# EasyEDA Pro project HT6872_D类功放测试板.eprj

# Schematic HT6872功放验证板
Create Date: 2024-03-28; Page Name: HT6872+SDB628; Project Name: HT6872_D类功放测试板; Schematic Name: Schematic1; Update Date: 2024-03-28; Company: 嘉立创EDA; Drawed: Cameron Bright; Page Size: A4; Version: V1.0
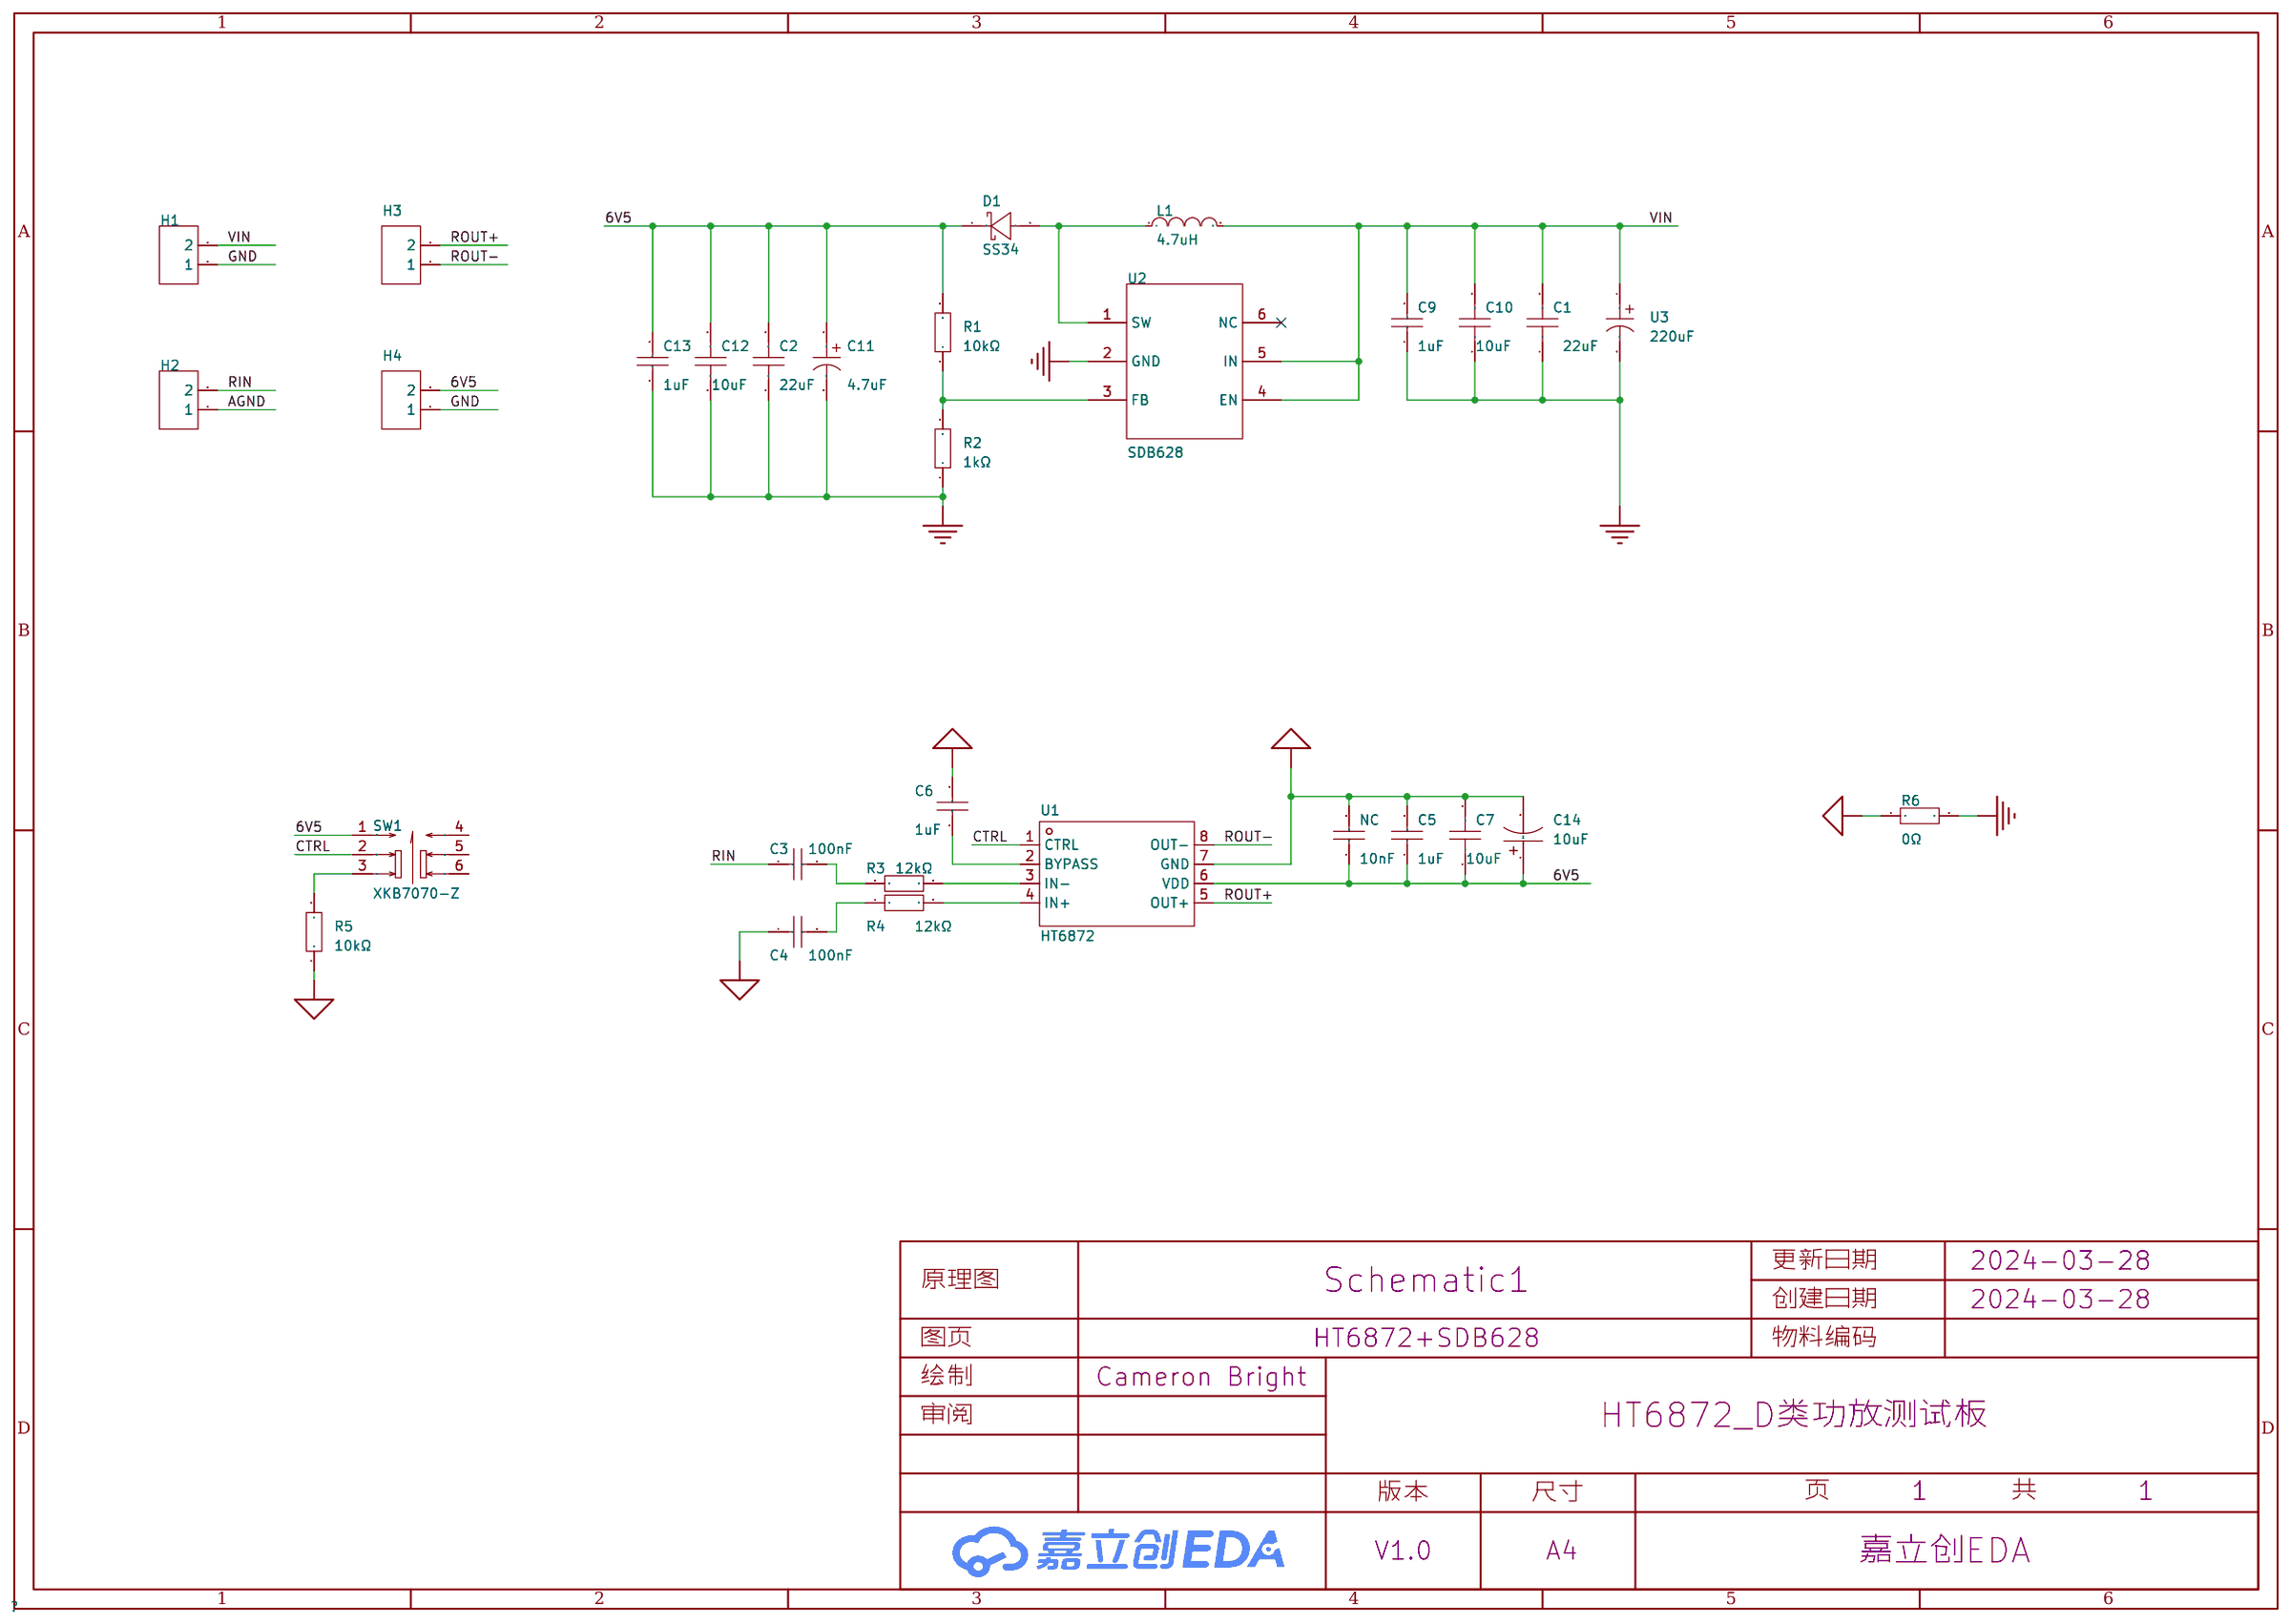
[diagram p0: schematic sheet]

## Parts
C1  22uF  [C0603]
C2  22uF  [C0603]
C3  100nF  [C0603]
C4  100nF  [C0603]
C5  1uF  [C0603]
C6  1uF  [C0603]
C7  10uF  [C0603]
C9  1uF  [C0603]
C10  10uF  [C0603]
C11  4.7uF  [CAP-TH_BD5.0-P2.00-D0.5-FD]
C12  10uF  [C0603]
C13  1uF  [C0603]
C14  10uF  [CAP-TH_BD5.0-P2.00-D0.8-FD]
D1  SS34  [SMA_L4.3-W2.5-LS5.0-RD]
H1  -  [HDR-TH_2P-P2.54-V-F]
H2  -  [HDR-TH_2P-P2.54-V-F]
H3  -  [HDR-TH_2P-P2.54-V-F]
H4  -  [HDR-TH_2P-P2.54-V-F]
L1  4.7uH  [IND-SMD_L4.4-W4.2]
NC  10nF  [C0603]
R1  10kΩ  [R0603]
R2  1kΩ  [R0603]
R3  12kΩ  [R0603]
R4  12kΩ  [R0603]
R5  10kΩ  [R0603]
R6  0Ω  [R0603]
SW1  XKB7070-Z  [SW-TH_6P-L7.0-W7.0-P2.00]
U1  HT6872  [SOP-8_L4.9-W3.9-P1.27-LS6.0-BL]
U2  SDB628  [SOT-23-6_L2.9-W1.6-P0.95-LS2.8-BR]
U3  220uF  [CAP-TH_BD8.0-P3.50-D0.5-FD]

## Library data of the parts
C1 C2 = CL10A226MQ8NRNC: 容值:22uF;精度:±20%;额定电压:6.3V;材质(温度系数):X5R;; LCSC Part Name: 22uF ±20% 6.3V; Supplier Part: C59461; Manufacturer: SAMSUNG(三星); Supplier Footprint: 0603; JLCPCB Part Class: 基础库; Datasheet: https://atta.szlcsc.com/upload/public/pdf/source/20160218/1457707763339.pdf; Supplier: LCSC; Tolerance: ±20%; Voltage Rated: 6.3V; Temperature Coefficient: X5R
C3 C4 = 0603B104K500NT: 容值:100nF;精度:±10%;额定电压:50V;材质(温度系数):X7R;; LCSC Part Name: 100nF ±10% 50V; Supplier Part: C30926; Manufacturer: FH(风华); Supplier Footprint: 0603; JLCPCB Part Class: 扩展库; Datasheet: https://atta.szlcsc.com/upload/public/pdf/source/20200305/C486355_26A10D38EF8C2A5C37091D0039909270.pdf; Supplier: LCSC; Tolerance: ±10%; Voltage Rated: 50V; Temperature Coefficient: X7R
C5 C6 C9 C13 = CL10A105KB8NNNC: 容值:1uF;精度:±10%;额定电压:50V;材质(温度系数):X5R;; LCSC Part Name: 1uF ±10% 50V; Supplier Part: C15849; Manufacturer: SAMSUNG(三星); Supplier Footprint: 0603; JLCPCB Part Class: 基础库; Datasheet: https://atta.szlcsc.com/upload/public/pdf/source/20160218/1457707763339.pdf; Supplier: LCSC; Tolerance: ±10%; Voltage Rated: 50V; Temperature Coefficient: X5R
C7 C10 C12 = CL10A106KP8NNNC: 容值:10uF;精度:±10%;额定电压:10V;材质(温度系数):X5R;; LCSC Part Name: 10uF ±10% 10V; Supplier Part: C19702; Manufacturer: SAMSUNG(三星); Supplier Footprint: 0603; JLCPCB Part Class: 基础库; Datasheet: https://atta.szlcsc.com/upload/public/pdf/source/20160218/1457707763339.pdf; Supplier: LCSC; Tolerance: ±10%; Voltage Rated: 10V; Temperature Coefficient: X5R
C11 = KM1H4R7M0407: 容值:4.7uF;精度:±20%;额定电压:50V;纹波电流:-;等效串联电阻:-;; LCSC Part Name: 4.7uF ±20% 50V; Supplier Part: C2873980; Manufacturer: ROQANG(容强); Supplier Footprint: 插件,D4xL7mm; JLCPCB Part Class: 扩展库; Datasheet: https://atta.szlcsc.com/upload/public/pdf/source/20240320/A280D10F34D0AFC5F78DD559A798EACC.pdf; Supplier: LCSC; Tolerance: ±20%; Rated Voltage: 50V; Lead Spacing: 1.5mm; φD: 4mm; L: 7mm
C14 = 01EC1809SHC10UF50V: 容值:10uF;精度:±20%;额定电压:50V;纹波电流:50mA@120Hz;等效串联电阻:-;; LCSC Part Name: 10uF ±20% 50V; Supplier Part: C503219; Manufacturer: KNSCHA(科尼盛); Supplier Footprint: 插件,D5xL11mm; JLCPCB Part Class: 扩展库; Datasheet: https://atta.szlcsc.com/upload/public/pdf/source/20200324/C503219_39D1683F20D4DB1C41D8BE9142629697.pdf; Supplier: LCSC; Tolerance: ±20%; Rated Voltage: 50V; Ripple Current: 50mA@120Hz; Lead Spacing: 2mm; φD: 5mm; L: 11mm; Lifetime @ Temp: 5000hrs@105℃
D1 = SS34_C727060: 二极管配置:独立式;正向压降(Vf):550mV@3A;直流反向耐压(Vr):40V;平均整流电流(Io):3A;; LCSC Part Name: 电压:40V 电流:3A; Supplier Part: C727060; Manufacturer: TWGMC(台湾迪嘉); Supplier Footprint: SMA(DO-214AC); JLCPCB Part Class: 扩展库; Datasheet: https://atta.szlcsc.com/upload/public/pdf/source/20200828/C727059_6599B6CAC5F3238B9C33E46794659DBE.pdf; Supplier: LCSC; Diode Configuration: 独立式; Forward Voltage (Vf@If): 550mV@3A; Reverse Voltage (Vr): 40V; Average Rectified Current (Io): 3A; Reverse Leakage Current (Ir): 500uA@40V
H1-H4 = HDR-F_2.54_1x2P: Supplier Part: C49661; Supplier Footprint: 插件
L1 = FXL0420-4R7-M: 电感值:4.7uH;精度:±20%;额定电流:2.8A;饱和电流(Isat):3A;类型:一体成型电感;; LCSC Part Name: 4.7uH ±20% 3A; Supplier Part: C167208; Manufacturer: cjiang(长江微电); Supplier Footprint: SMD,4.2x4.4mm; JLCPCB Part Class: 扩展库; Datasheet: https://atta.szlcsc.com/upload/public/pdf/source/20230516/FBADA9890E7FBE97C620F1D8B562D733.pdf; Supplier: LCSC; Tolerance: ±20%; Rated Current: 2.8A; Saturation Current (Isat): 3A; DC Resistance (DCR): 105mΩ; Type: 一体成型电感
NC = CC0603KRX7R9BB103: 容值:10nF;精度:±10%;额定电压:50V;材质(温度系数):X7R;; LCSC Part Name: 10nF ±10% 50V; Supplier Part: C100042; Manufacturer: YAGEO(国巨); Supplier Footprint: 0603; JLCPCB Part Class: 扩展库; Datasheet: https://atta.szlcsc.com/upload/public/pdf/source/20181008/C309510_22F155564471FAF6A489F7D68F34234E.pdf; Supplier: LCSC; Tolerance: ±10%; Voltage Rated: 50V; Temperature Coefficient: X7R
R1 R5 = 0603WAF1002T5E: 电阻类型:厚膜电阻;阻值:10kΩ;精度:±1%;功率:100mW;最大工作电压:75V;温度系数:±100ppm/℃;; LCSC Part Name: 厚膜电阻 10kΩ ±1% 100mW; Supplier Part: C25804; Manufacturer: UNI-ROYAL(厚声); Supplier Footprint: 0603; JLCPCB Part Class: 基础库; Datasheet: https://atta.szlcsc.com/upload/public/pdf/source/20200306/C422600_1E6D84923E4A46A82E41ADD87F860B5C.pdf; Supplier: LCSC; Type: 厚膜电阻; Tolerance: ±1%; Power(Watts): 100mW; Overload Voltage (Max): 75V; Temperature Coefficient: ±100ppm/℃; Operating Temperature Range: -55℃~+155℃
R2 = RC0603FR-071KL: 电阻类型:厚膜电阻;阻值:1kΩ;精度:±1%;功率:100mW;最大工作电压:75V;温度系数:±100ppm/℃;; LCSC Part Name: 厚膜电阻 1kΩ ±1% 100mW; Supplier Part: C22548; Manufacturer: YAGEO(国巨); Supplier Footprint: 0603; JLCPCB Part Class: 扩展库; Datasheet: https://atta.szlcsc.com/upload/public/pdf/source/20180316/70C0E2BDAE7FCC62C531A5A58D202EE1.pdf; Supplier: LCSC; Type: 厚膜电阻; Tolerance: ±1%; Power(Watts): 100mW; Overload Voltage (Max): 75V; Temperature Coefficient: ±100ppm/℃; Operating Temperature Range: -55℃~+155℃
R3 R4 = 0603WAF1202T5E: 电阻类型:厚膜电阻;阻值:12kΩ;精度:±1%;功率:100mW;最大工作电压:75V;温度系数:±100ppm/℃;; LCSC Part Name: 12kΩ ±1% 100mW 厚膜电阻; Supplier Part: C22790; Manufacturer: UNI-ROYAL(厚声); Supplier Footprint: 0603; JLCPCB Part Class: 基础库; Datasheet: https://atta.szlcsc.com/upload/public/pdf/source/20200306/C422600_1E6D84923E4A46A82E41ADD87F860B5C.pdf; Supplier: LCSC; Type: 厚膜电阻; Tolerance: ±1%; Power(Watts): 100mW; Overload Voltage (Max): 75V; Temperature Coefficient: ±100ppm/℃; Operating Temperature Range: -55℃~+155℃
R6 = 0603WAF0000T5E: 电阻类型:厚膜电阻;阻值:0Ω;精度:±1%;功率:100mW;最大工作电压:75V;; LCSC Part Name: 0Ω ±1% 100mW 厚膜电阻; Supplier Part: C21189; Manufacturer: UNI-ROYAL(厚声); Supplier Footprint: 0603; JLCPCB Part Class: 基础库; Datasheet: https://atta.szlcsc.com/upload/public/pdf/source/20200306/C422600_1E6D84923E4A46A82E41ADD87F860B5C.pdf; Supplier: LCSC; Type: 厚膜电阻; Tolerance: ±1%; Power(Watts): 100mW; Overload Voltage (Max): 75V; Operating Temperature Range: -55℃~+155℃
SW1 = XKB7070-Z: 自锁/无锁:自锁;安装方式:直插;触点电流:100mA;额定电压 (AC):250V;额定电压 (DC):30V;带灯:不带;作用力:160gf;机械寿命:10万次;; LCSC Part Name: 按键开关   7*7插件自锁 蓝白黑; Supplier Part: C318863; Manufacturer: XKB Connectivity(中国星坤); Supplier Footprint: 插件; JLCPCB Part Class: 扩展库; Datasheet: https://atta.szlcsc.com/upload/public/pdf/source/20211015/75A682A27A424BDE8D93C2CFA14C38FE.pdf; Supplier: LCSC; Self Lock / No Lock: 自锁; Actuator Style: 矩形按钮; Mounting Style: 直插; Contact Current: 100mA; Voltage Rating (AC): 250V; Voltage Rating (DC): 30V; Insulation Resistance: 100MΩ; Actuator/Cap Color: 蓝色; With Lamp: 不带; Pin Style: PC引脚; Operating Force: 160gf; Operating Temperature: -15℃~+55℃; Mechanical Life: 10万次
U1 = HT6872: 功放类型:D类功放;扬声器通道数:单声道;输出功率:3.85Wx1@4Ω;; LCSC Part Name: 3.85W单声道D类音频功率放大器; Supplier Part: C93112; Manufacturer: 嘉兴禾润; Supplier Footprint: SOP-8; JLCPCB Part Class: 扩展库; Datasheet: https://atta.szlcsc.com/upload/public/pdf/source/20170925/C93112_1506321759294990568.pdf; Supplier: LCSC; Type of Power Amplifier: D类功放; Speaker Channels: 单声道; Output Power: 3.85Wx1@4Ω; Supply Voltage: 2.5V~6.5V
U2 = SDB628: 功能类型:升压型;输入电压:2V~24V;输出电压:28V;输出电流(最大值):2A;; Supplier Part: C77805; Manufacturer: SHOUDING(首鼎半导体); Supplier Footprint: SOT-23-6; JLCPCB Part Class: 扩展库; Datasheet: https://atta.szlcsc.com/upload/public/pdf/source/20160823/1471947522087.pdf; Supplier: LCSC; Function: 升压型; Input Voltage: 2V~24V; Output Voltage: 28V; Output Current (Max): 2A; Switching Frequency: 1.2MHz; Synchronous Rectification: 否; Number of Outputs: 1; Topology: 升压式; Switch tube (built-in/external): 内置
U3 = 01EC1230: 容值:220uF;精度:±20%;额定电压:35V;纹波电流:280mA@120kHz;等效串联电阻:-;; LCSC Part Name: 220uF ±20% 35V; Supplier Part: C2831783; Manufacturer: KNSCHA(科尼盛); Supplier Footprint: 插件,D8xL12mm; JLCPCB Part Class: 扩展库; Datasheet: https://atta.szlcsc.com/upload/public/pdf/source/20210507/C2831783_57665407C268EE999E0BAC2FD481F51A.pdf; Supplier: LCSC; Tolerance: ±20%; Rated Voltage: 35V; Ripple Current: 280mA@120kHz; Lead Spacing: 3.5mm; φD: 8mm; L: 12mm; Lifetime @ Temp: 2000hrs@105℃; Operating Temperature: -40℃~+105℃

## Nets
6V5: C2.2 C5.1 C7.1 C11.1 C12.2 C13.2 C14.1 D1.1(C) H4.2 NC.1 R1.2 SW1.1 U1.6(VDD)
AGND: C4.1 C5.2 C6.2 C7.2 C14.2 H2.1 NC.2 R5.1 R6.1 U1.7(GND)
GND: C1.1 C2.1 C9.1 C10.1 C11.2 C12.1 C13.1 H1.1 H4.1 R2.1 R6.2 U2.2(GND) U3.2
VIN: C1.2 C9.2 C10.2 H1.2 L1.2 U2.4(EN) U2.5(IN) U3.1
CTRL: SW1.2 U1.1(CTRL)
RIN: C3.1 H2.2
ROUT+: H3.2 U1.5(OUT+)
ROUT-: H3.1 U1.8(OUT-)
$1N375: D1.2(A) L1.1 U2.1(SW)
$1N556: R1.1 R2.2 U2.3(FB)
$1N748: R3.2 U1.3(IN-)
$1N751: R4.2 U1.4(IN+)
$1N898: C3.2 R3.1
$1N903: C4.2 R4.1
$1N1214: C6.1 U1.2(BYPASS)
$1N1348: R5.2 SW1.3

Not connected (* = marked no-connect by the designer): SW1 4 5 6; U2 6(NC)*

# Board PCB1
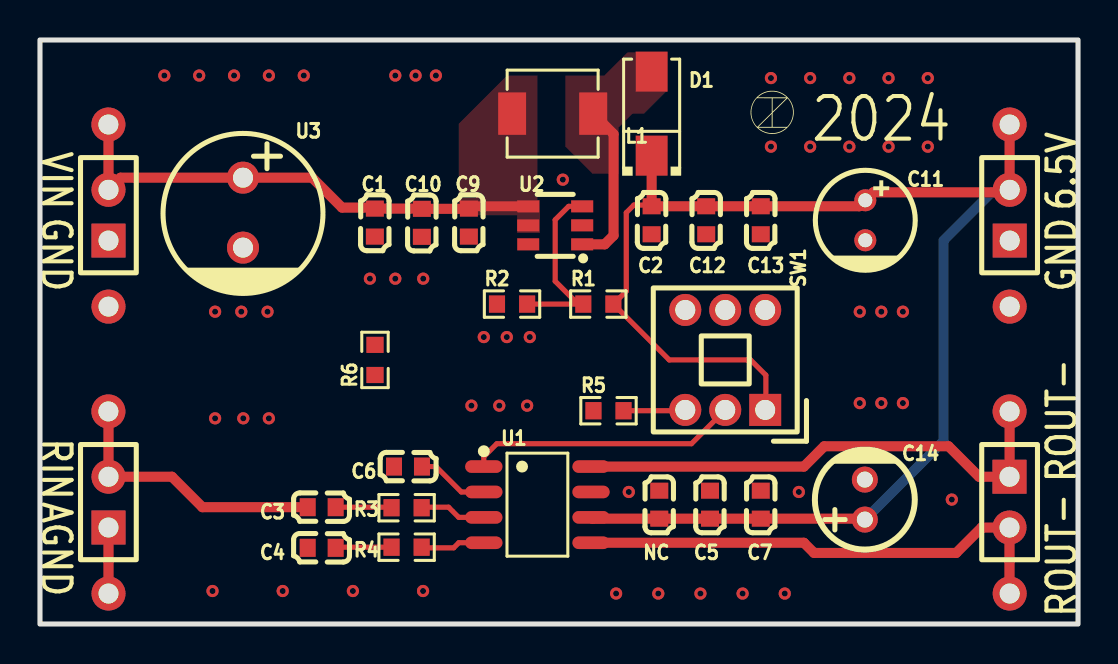
[diagram p1: board, top side]
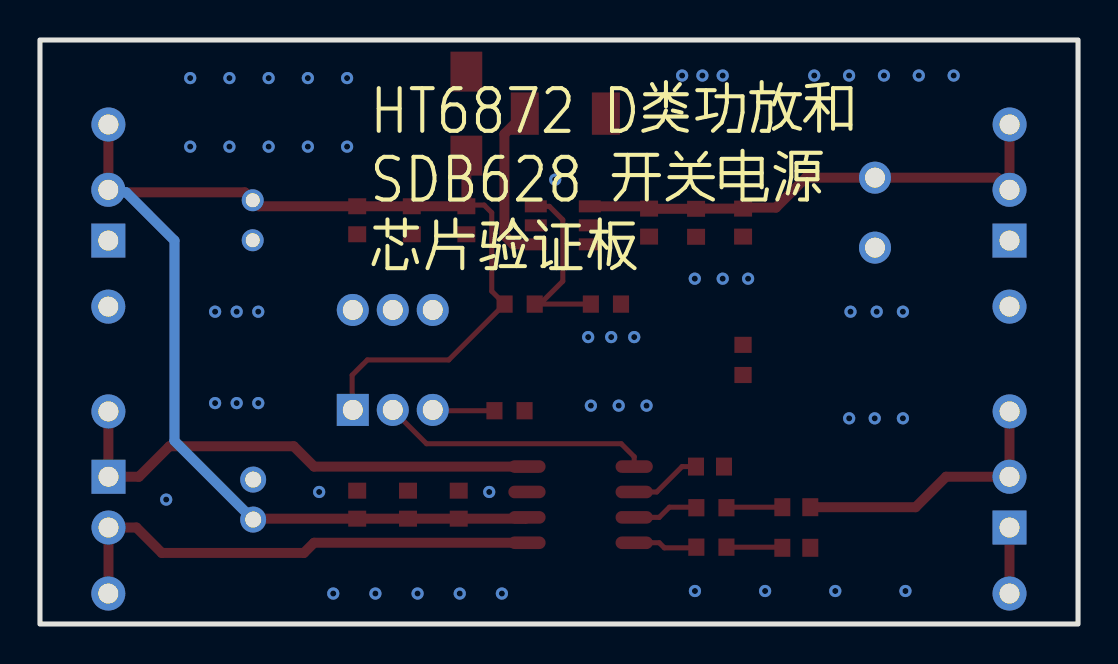
[diagram p2: board, bottom side, seen from below]

Outline 51.94 x 29.21 mm; copper layers: Top Layer, Bottom Layer. Coordinates in mm from the lower left corner of the outline.
Outline path: rectangle 0,29.21 51.94,0
Stack: Top Layer 0.035mm / Dielectric1 1.51mm FR4 er 4.5 / Bottom Layer 0.035mm

## Design rules (mm)
template: 自定义配置
spacing copperThickness1oz (default): track to track 0.102, other pairs 0.152 to 0.3
spacing copperThickness2oz: track to track 0.203, other pairs 0.152 to 0.3
track width copperThickness1oz (default): min 0.127, default 0.254, max 2.54
track width copperThickness2oz: min 0.203, default 0.254, max 2.54
differential pair differentialPair (default): width min 0.127, default 0.254, max 2.54; gap min 0.152, default 0.152
via viaSize (default): diameter min 0.5, default 0.61, max 10; hole min 0.3, default 0.305, max 6.3

## Placement (name value [footprint] x y rotation side)
C1  22uF  [C0603]  16.76 20.08 90 top
C2  22uF  [C0603]  30.61 20.19 90 top
C3  100nF  [C0603]  14.1 5.84 0 top
C4  100nF  [C0603]  14.1 3.81 0 top
C5  1uF  [C0603]  33.53 5.97 90 top
C6  1uF  [C0603]  18.41 7.87 180 top
C7  10uF  [C0603]  36.07 5.97 90 top
C9  1uF  [C0603]  21.46 20.08 90 top
C10  10uF  [C0603]  19.11 20.07 90 top
C11  4.7uF  [CAP-TH_BD5.0-P2.00-D0.5-FD]  41.3 20.19 270 top
C12  10uF  [C0603]  33.34 20.19 90 top
C13  1uF  [C0603]  36.07 20.19 90 top
C14  10uF  [CAP-TH_BD5.0-P2.00-D0.8-FD]  41.28 6.22 90 top
D1  SS34  [SMA_L4.3-W2.5-LS5.0-RD]  30.61 25.53 90 top
H1  -  [HDR-TH_2P-P2.54-V-F]  3.43 20.45 90 top
H2  -  [HDR-TH_2P-P2.54-V-F]  3.43 6.1 90 top
H3  -  [HDR-TH_2P-P2.54-V-F]  48.51 6.1 270 top
H4  -  [HDR-TH_2P-P2.54-V-F]  48.52 20.45 90 top
L1  4.7uH  [IND-SMD_L4.4-W4.2]  25.65 25.53 0 top
NC  10nF  [C0603]  30.99 5.97 90 top
NOREF  -  [Pad_e267]  3.43 15.87 0 top
NOREF#2  -  [Pad_e271]  48.52 15.87 0 top
NOREF#3  -  [Pad_e263]  3.42 10.63 0 top
NOREF#4  -  [Pad_e269]  48.52 1.52 0 top
NOREF#5  -  [Pad_e264]  3.43 1.52 0 top
NOREF#6  -  [Pad_e266]  3.42 24.98 0 top
NOREF#7  -  [Pad_e270]  48.52 24.98 0 top
NOREF#8  -  [Pad_e268]  48.52 10.63 0 top
R1  10kΩ  [R0603]  27.94 16 0 top
R2  1kΩ  [R0603]  23.62 16 0 top
R3  12kΩ  [R0603]  18.35 5.82 0 top
R4  12kΩ  [R0603]  18.35 3.84 0 top
R5  10kΩ  [R0603]  28.45 10.67 0 top
R6  0Ω  [R0603]  16.76 13.21 90 top
SW1  XKB7070-Z  [SW-TH_6P-L7.0-W7.0-P2.00]  34.29 13.21 270 top
U1  HT6872  [SOP-8_L4.9-W3.9-P1.27-LS6.0-BL]  24.89 5.97 270 top
U2  SDB628  [SOT-23-6_L2.9-W1.6-P0.95-LS2.8-BR]  25.78 19.94 0 top
U3  220uF  [CAP-TH_BD8.0-P3.50-D0.5-FD]  10.16 20.57 270 top

## Footprints (pads in the part's own frame, mm; a bottom-side part is the same pattern mirrored in y, then rotated)
C0603
  rect 0.8x0.9 smd: 1(-0.7,0) 2(0.7,0)
CAP-TH_BD5.0-P2.00-D0.5-FD
  round 1.1 hole 0.7: 1(-1,0) 2(1,0)
CAP-TH_BD5.0-P2.00-D0.8-FD
  round 1.3 hole 0.8: 1(-1,0) 2(1,0)
CAP-TH_BD8.0-P3.50-D0.5-FD
  round 1.6 hole 1: 1(-1.75,0) 2(1.75,0)
HDR-TH_2P-P2.54-V-F
  rect 1.7x1.7 hole 1: 1(-1.27,0)
  round 1.7 hole 1: 2(1.27,0)
IND-SMD_L4.4-W4.2
  rect 1.4x2.12 smd: 1(2.028,0) 2(-2.028,0)
Pad_e263
  round 1.7 hole 1: 9(0,0)
Pad_e264
  round 1.7 hole 1: 10(0,0)
Pad_e266
  round 1.7 hole 1: 9(0,0)
Pad_e267
  round 1.7 hole 1: 10(0,0)
Pad_e268
  round 1.7 hole 1: 9(0,0)
Pad_e269
  round 1.7 hole 1: 10(0,0)
Pad_e270
  round 1.7 hole 1: 9(0,0)
Pad_e271
  round 1.7 hole 1: 10(0,0)
R0603
  rect 0.806x0.864 smd: 1(-0.753,0) 2(0.753,0)
SMA_L4.3-W2.5-LS5.0-RD
  rect 2x1.593 smd: 1(-2.1,0) 2(2.1,0)
SOP-8_L4.9-W3.9-P1.27-LS6.0-BL
  oval 0.63x1.865 smd: 1(-1.905,-2.683) 2(-0.635,-2.683) 3(0.635,-2.683) 4(1.905,-2.683) 5(1.905,2.683) 6(0.635,2.683) 7(-0.635,2.683) 8(-1.905,2.683)
SOT-23-6_L2.9-W1.6-P0.95-LS2.8-BR
  rect 1.1x0.6 smd: 1(1.35,-0.95) 2(1.35,0) 3(1.35,0.95) 4(-1.35,0.95) 5(-1.35,0) 6(-1.35,-0.95)
SW-TH_6P-L7.0-W7.0-P2.00
  rect 1.6x1.6 hole 1: 1(2.499,2)
  round 1.6 hole 1: 2(2.5,0) 3(2.5,-2) 4(-2.5,2) 5(-2.5,0) 6(-2.5,-2)

## Nets
6V5: C2.2 C5.1 C7.1 C11.1 C12.2 C13.2 C14.1 D1.1 H4.2 NC.1 NOREF#7.9 R1.2 SW1.1 U1.6
AGND: C4.1 C5.2 C6.2 C7.2 C14.2 H2.1 NC.2 NOREF#5.10 R5.1 R6.1 U1.7
GND: C1.1 C2.1 C9.1 C10.1 C11.2 C12.1 C13.1 H1.1 H4.1 NOREF.10 NOREF#2.10 R2.1 R6.2 U2.2 U3.2
VIN: C1.2 C9.2 C10.2 H1.2 L1.2 NOREF#6.9 U2.4 U2.5 U3.1
CTRL: SW1.2 U1.1
RIN: C3.1 H2.2 NOREF#3.9
ROUT+: H3.2 NOREF#4.10 U1.5
ROUT-: H3.1 NOREF#8.9 U1.8
$1N375: D1.2 L1.1 U2.1
$1N556: R1.1 R2.2 U2.3
$1N748: R3.2 U1.3
$1N751: R4.2 U1.4
$1N898: C3.2 R3.1
$1N903: C4.2 R4.1
$1N1214: C6.1 U1.2
$1N1348: R5.2 SW1.3

Pads without a net: SW1 4 5 6; U2 6

## Via types
v1: diameter 0.61, hole 0.305, Top Layer to Bottom Layer, 52 vias

## Routing (per net, layer and track width the routed paths; a pad name or vN(x,y) marks a point on that pad's centre or on a via; arc(x,y) is an arc through that point)
6V5: length 75.1
  Top Layer w0.254: C2.2 30.54,20.95 29.72,20.95 29.34,20.57 29.34,16.65 R1.2 31.49,13.21 35.56,13.21 36.32,12.45 36.32,10.74 SW1.1
  Top Layer w0.5: D1.1 C2.2 C12.2 C13.2 41,20.89 C11.1 41.69,21.59 48.4,21.59 48.52,21.72 48.52,21.72 NOREF#7.9 ; U1.6 27.64,5.27 NC.1 C5.1 C7.1 41.23,5.27 C14.1
  Bottom Layer w0.5: 48.77,21.59 47.62,21.59 45.21,19.18 45.21,9.16 C14.1
AGND: length 3.3
  Top Layer w0.5: H2.1 NOREF#5.10
  vias: v1(8.64,1.65) v1(8.76,10.29) v1(10.17,10.29) v1(11.45,10.29) v1(12.15,1.65) v1(15.66,1.65) v1(19.17,1.65) v1(21.59,10.92) v1(22.98,10.92) v1(24.38,10.92) v1(28.83,1.52) v1(29.46,6.6) v1(30.94,1.52) v1(33.05,1.52) v1(35.16,1.52) v1(37.27,1.52) v1(37.97,6.6) v1(41.02,11.05) v1(42.1,11.05) v1(43.18,11.05) v1(45.63,6.22)
GND:
  vias: v1(6.22,27.43) v1(7.97,27.43) v1(8.76,15.62) v1(9.71,27.43) v1(10.07,15.62) v1(11.39,15.62) v1(11.46,27.43) v1(13.2,27.43) v1(16.51,17.27) v1(17.78,27.43) v1(17.78,17.27) v1(18.8,27.43) v1(19.18,17.27) v1(19.81,27.43) v1(22.21,14.35) v1(23.36,14.35) v1(24.51,14.35) v1(26.16,22.22) v1(36.58,27.3) v1(36.58,23.88) v1(38.54,27.3) v1(38.54,23.88) v1(40.5,27.3) v1(40.5,23.88) v1(41.02,15.62) v1(42.1,15.62) v1(42.46,27.3) v1(42.46,23.88) v1(43.18,15.62) v1(44.43,27.3) v1(44.43,23.88)
VIN: length 25.2
  Top Layer w0.5: U2.4 21.58,20.89 C9.2 21.45,20.77 C10.2 19.1,20.78 C1.2 16.71,20.83 15.11,20.83 13.62,22.32 U3.1 4.04,22.32 3.43,21.72 3.43,24.98 NOREF#6.9
CTRL: length 13.5
  Top Layer w0.254: U1.1 22.21,8.37 22.86,9.02 32.6,9.02 SW1.2
RIN: length 13.9
  Top Layer w0.5: NOREF#3.9 3.43,10.63 H2.2 6.6,7.37 8.13,5.84 C3.1
ROUT+: length 25
  Top Layer w0.5: NOREF#4.10 48.51,1.53 H3.2 47.12,4.83 45.85,3.56 38.73,3.56 38.23,4.06 U1.5
ROUT-: length 25.3
  Top Layer w0.5: U1.8 38.23,7.87 39.24,8.89 45.47,8.89 46.99,7.37 H3.1 48.52,7.37 NOREF#8.9
$1N375: length 8.3
  Top Layer w0.5: U2.1 28.26,18.99 28.7,19.43 28.7,24.51 L1.1
$1N556: length 9.1
  Top Layer w0.254: 26.92,16 25.78,17.14 25.78,20.22 26.45,20.89 U2.3 ; 26.92,16 R2.2 ; 26.92,16 R1.1
$1N748: length 3.3
  Top Layer w0.254: U1.3 20.96,5.33 20.45,5.84 19.12,5.84 R3.2
$1N751: length 3.2
  Top Layer w0.254: R4.2 19.13,3.81 20.7,3.81 20.96,4.06 U1.4
$1N898: length 2.8
  Top Layer w0.254: C3.2 17.57,5.84 R3.1
$1N903: length 2.8
  Top Layer w0.254: C4.2 14.83,3.84 R4.1
$1N1214: length 3.6
  Top Layer w0.254: U1.2 21.08,6.6 19.81,7.87 C6.1
$1N1348: length 3.1
  Top Layer w0.254: R5.2 32.25,10.67 SW1.3

## Copper pours and planes (outline as drawn; the poured copper is in the pictures)
AGND on Top Layer: 0.38,12.83 51.69,12.83 51.69,0.25 0.38,0.25
AGND on Bottom Layer: 0.38,12.83 51.69,12.83 51.69,0.25 0.38,0.25
GND on Top Layer: 0,29.21 51.69,29.21 51.69,13.46 0,13.46
GND on Bottom Layer: 0.26,28.94 51.69,28.94 51.69,13.46 0.26,13.46
VIN on Top Layer: 23.88,21.21 25.02,21.21 25.02,19.56 23.88,19.56
VIN on Top Layer: 20.96,27.43 24.89,27.43 24.89,20.45 20.96,20.45
$1N375 on Top Layer: 26.29,28.6 31.37,28.6 31.37,22.52 26.29,22.52

## Text on the board
Bottom Silkscreen Layer: HT6872 D类功放和 / SDB628 开关电源 / 芯片验证板
Top Silkscreen Layer: VIN | GND | RIN | AGND | 6.5V | ROUT- | 2024
